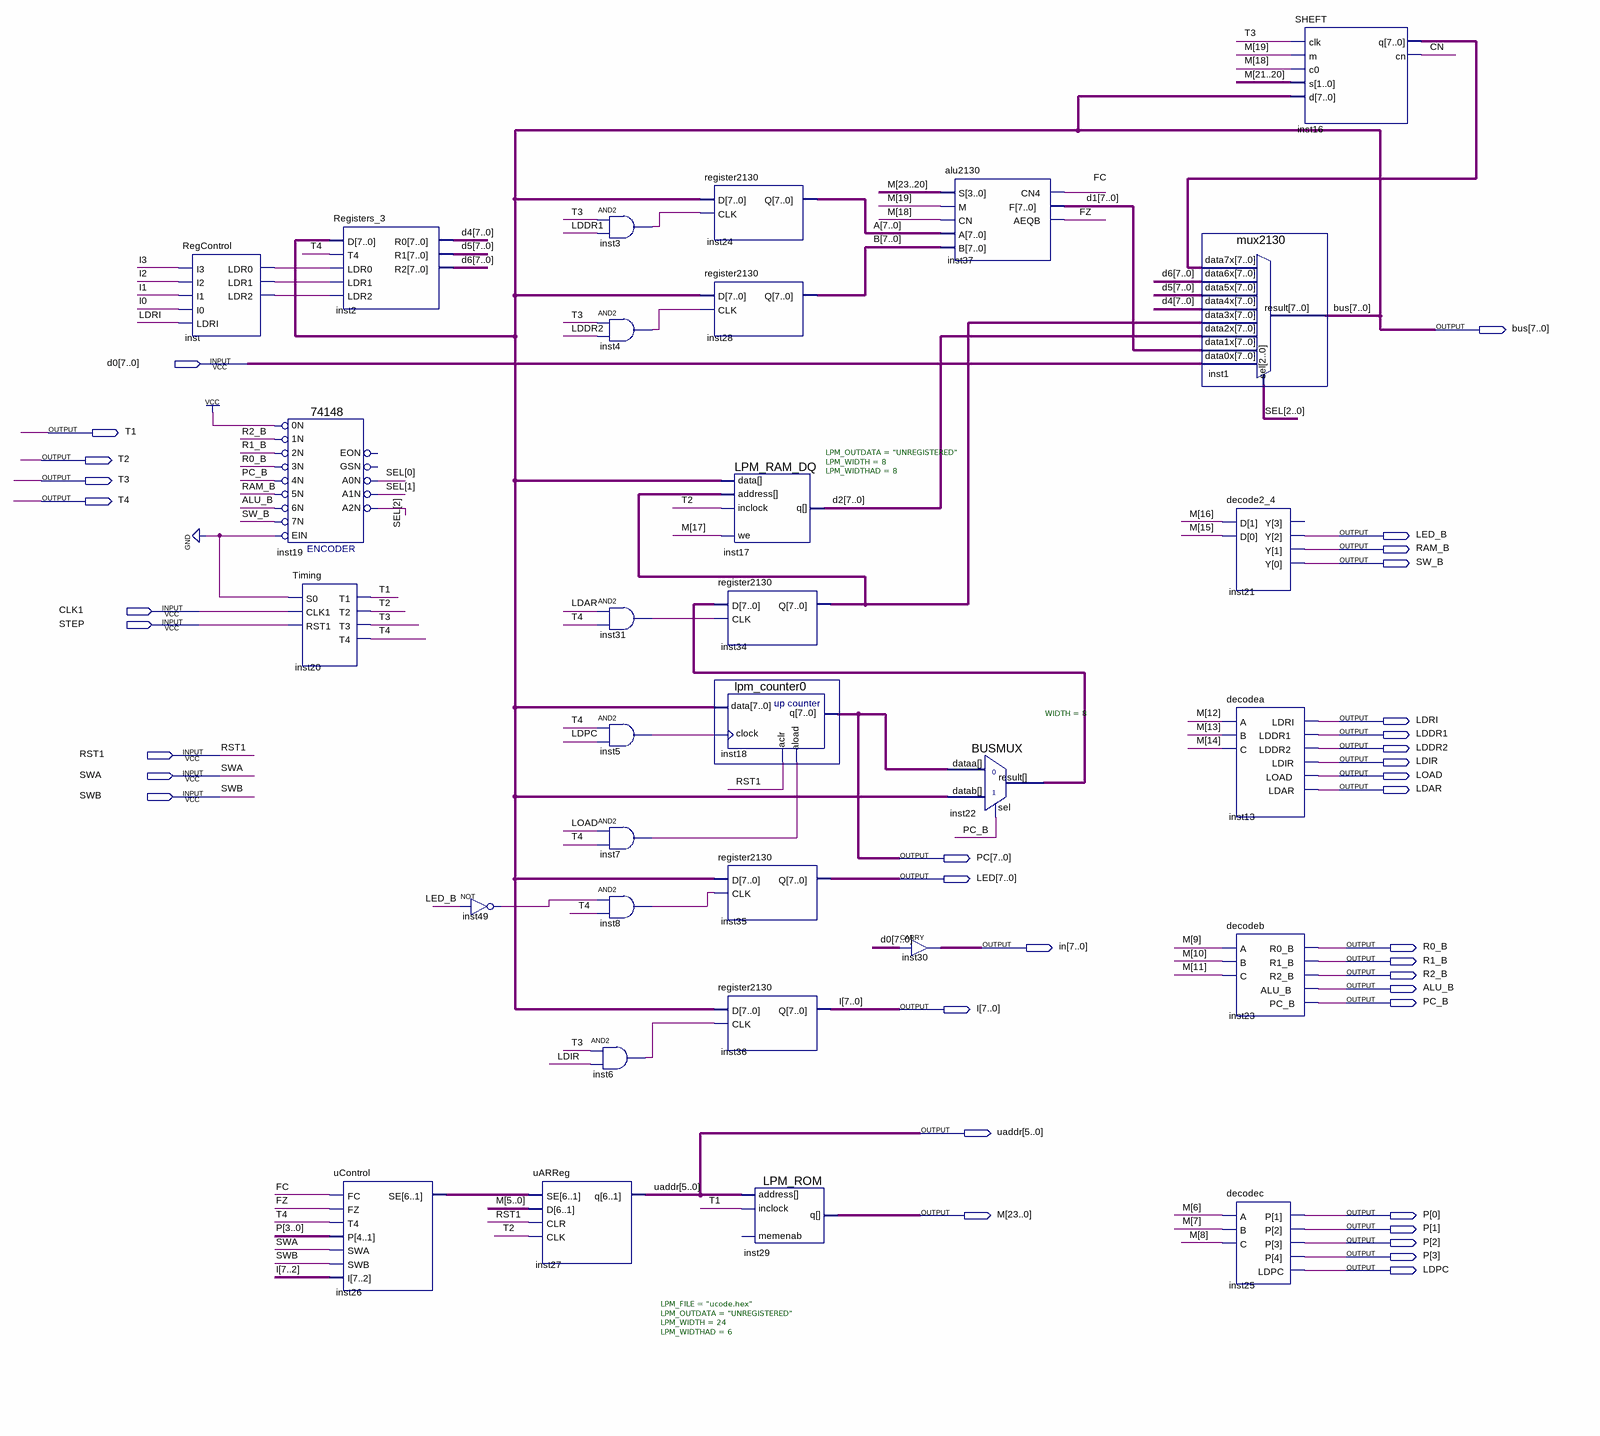
[diagram p0: schematic sheet]
// Quartus schematic Computer2130.bdf as structural Verilog: 31 symbols, 36 pins
module Computer2130 (
  input  [7:0] d0,
  input  CLK1,
  input  STEP,
  input  RST1,
  input  SWA,
  input  SWB,
  output [7:0] bus,
  output T1,
  output T2,
  output T3,
  output T4,
  output LED_B,
  output RAM_B,
  output SW_B,
  output LDRI,
  output LDDR1,
  output LDDR2,
  output LDIR,
  output LOAD,
  output LDAR,
  output [7:0] PC,
  output [7:0] LED,
  output [7:0] in,
  output R0_B,
  output R1_B,
  output R2_B,
  output ALU_B,
  output PC_B,
  output [7:0] I,
  output [5:0] uaddr,
  output [23:0] M,
  output [3:0] P,
  output LDPC
);

  wire CN, FC, FZ, inst3_out, inst4_out, inst5_out, inst6_out, inst7_out, inst8_out, inst31_out, inst49_out,
       inst_ldr0, inst_ldr1, inst_ldr2;
  wire [2:0] SEL;
  wire [5:0] inst26_se;
  wire [7:0] A, B, d1, d2, d4, d5, d6, inst16_q, inst22_result, inst34_q;
  wire [3:0] inst21_y_open;  // unused outputs

  RegControl inst (
    .I3(I[3]), .I2(I[2]), .I1(I[1]), .I0(I[0]), .LDRI(LDRI), .LDR0(inst_ldr0), .LDR1(inst_ldr1),
    .LDR2(inst_ldr2));
  \74148  inst19 (
    .\5N (RAM_B), .\0N (1'b1), .\1N (R2_B), .\2N (R1_B), .\3N (R0_B), .\4N (PC_B), .EIN(1'b0), .\6N (ALU_B),
    .\7N (SW_B), .A1N(SEL[1]), .A0N(SEL[0]), .A2N(SEL[2]));  // open: EON, GSN
  Timing inst20 (.S0(1'b0), .CLK1(CLK1), .RST1(STEP), .T1(T1), .T2(T2), .T3(T3), .T4(T4));
  Registers_3 inst2 (.D(bus), .T4(T4), .LDR0(inst_ldr0), .LDR1(inst_ldr1), .LDR2(inst_ldr2), .R0(d4), .R1(d5), .R2(d6));
  uControl inst26 (.FC(FC), .FZ(FZ), .T4(T4), .P(P), .SWA(SWA), .SWB(SWB), .I(I[7:2]), .SE(inst26_se));
  not inst49 (inst49_out, LED_B);
  uARReg inst27 (.SE(inst26_se), .D(M[5:0]), .CLR(RST1), .CLK(T2), .q(uaddr));
  and inst3 (inst3_out, T3, LDDR1);
  and inst4 (inst4_out, T3, LDDR2);
  and inst31 (inst31_out, LDAR, T4);
  and inst5 (inst5_out, T4, LDPC);
  and inst7 (inst7_out, LOAD, T4);
  and inst8 (inst8_out, inst49_out, T4);
  and inst6 (inst6_out, T3, LDIR);
  register2130 inst24 (.D(bus), .CLK(inst3_out), .Q(A));
  register2130 inst28 (.D(bus), .CLK(inst4_out), .Q(B));
  LPM_RAM_DQ #(.LPM_OUTDATA("UNREGISTERED"), .LPM_WIDTH(8), .LPM_WIDTHAD(8)) inst17 (
    .address(inst34_q), .data(bus), .inclock(T2), .we(M[17]), .q(d2));
  register2130 inst34 (.D(inst22_result), .CLK(inst31_out), .Q(inst34_q));
  lpm_counter0 inst18 (.data(bus), .clock(inst5_out), .aclr(RST1), .aload(inst7_out), .q(PC));
  register2130 inst35 (.D(bus), .CLK(inst8_out), .Q(LED));
  register2130 inst36 (.D(bus), .CLK(inst6_out), .Q(I));
  LPM_ROM #(.LPM_FILE("ucode.hex"), .LPM_OUTDATA("UNREGISTERED"), .LPM_WIDTH(24), .LPM_WIDTHAD(6)) inst29 (
    .address(uaddr), .inclock(T1), .q(M));  // open: memenab
  CARRY inst30[7:0] (.IN(d0), .OUT(in));
  alu2130 inst37 (.S(M[23:20]), .M(M[19]), .CN(M[18]), .A(A), .B(B), .CN4(FC), .F(d1), .AEQB(FZ));
  BUSMUX #(.WIDTH(8)) inst22 (.datab(bus), .sel(PC_B), .dataa(PC), .result(inst22_result));
  mux2130 inst1 (
    .data7x(inst16_q), .data6x(d6), .data5x(d5), .data4x(d4), .data3x(inst34_q), .data2x(d2), .data1x(d1),
    .data0x(d0), .sel(SEL), .result(bus));
  decode2_4 inst21 (.D(M[16:15]), .Y({inst21_y_open[3], LED_B, RAM_B, SW_B}));
  decodea inst13 (
    .A(M[12]), .B(M[13]), .C(M[14]), .LDRI(LDRI), .LDDR1(LDDR1), .LDDR2(LDDR2), .LDIR(LDIR), .LOAD(LOAD),
    .LDAR(LDAR));
  decodeb inst23 (.A(M[9]), .B(M[10]), .C(M[11]), .R0_B(R0_B), .R1_B(R1_B), .R2_B(R2_B), .ALU_B(ALU_B), .PC_B(PC_B));
  decodec inst25 (.A(M[6]), .B(M[7]), .C(M[8]), .P(P), .LDPC(LDPC));
  SHEFT inst16 (.clk(T3), .m(M[19]), .c0(M[18]), .s(M[21:20]), .d(bus), .q(inst16_q), .cn(CN));
endmodule
